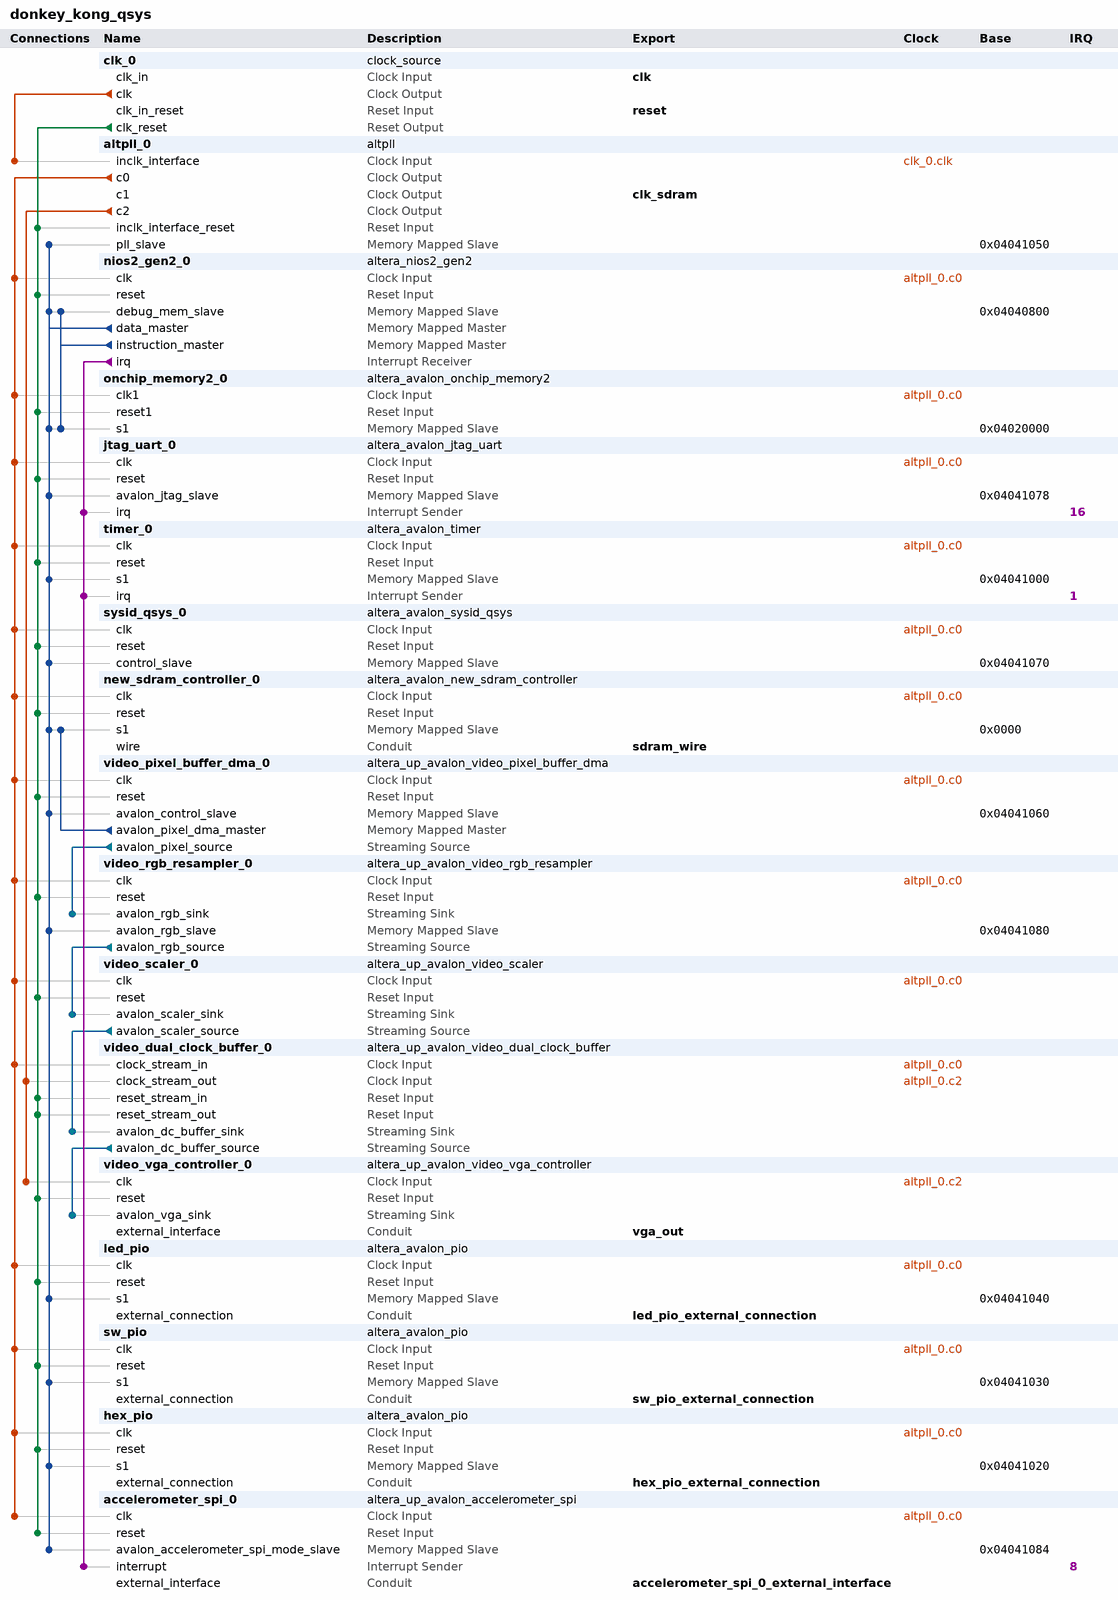
[diagram p0: system contents]
# Platform Designer (Qsys) system donkey_kong_qsys, MAX 10 10M50DAF484C7G
# Parameters at their usual value, and those the tool derives, are not listed.
package require -exact qsys 18.1
create_system donkey_kong_qsys
set_project_property DEVICE_FAMILY {MAX 10}
set_project_property DEVICE 10M50DAF484C7G

add_instance clk_0 clock_source 18.1
set_instance_parameter_value clk_0 clockFrequency 50000000

add_instance altpll_0 altpll 18.1
set_instance_parameter_value altpll_0 CLK0_DIVIDE_BY 1
set_instance_parameter_value altpll_0 CLK0_MULTIPLY_BY 1
set_instance_parameter_value altpll_0 CLK1_DIVIDE_BY 1
set_instance_parameter_value altpll_0 CLK1_DUTY_CYCLE 50
set_instance_parameter_value altpll_0 CLK1_MULTIPLY_BY 1
set_instance_parameter_value altpll_0 CLK1_PHASE_SHIFT -3000
set_instance_parameter_value altpll_0 CLK2_DIVIDE_BY 2
set_instance_parameter_value altpll_0 CLK2_DUTY_CYCLE 50
set_instance_parameter_value altpll_0 CLK2_MULTIPLY_BY 1
set_instance_parameter_value altpll_0 CLK2_PHASE_SHIFT 0
set_instance_parameter_value altpll_0 INCLK0_INPUT_FREQUENCY 20000
set_instance_parameter_value altpll_0 PORT_ARESET PORT_UNUSED
set_instance_parameter_value altpll_0 PORT_LOCKED PORT_UNUSED
set_instance_parameter_value altpll_0 PORT_clk1 PORT_USED
set_instance_parameter_value altpll_0 PORT_clk2 PORT_USED
set_instance_parameter_value altpll_0 PORT_clk3 PORT_UNUSED

add_instance nios2_gen2_0 altera_nios2_gen2 18.1
set_instance_parameter_value nios2_gen2_0 dcache_size 2048
set_instance_parameter_value nios2_gen2_0 exceptionSlave onchip_memory2_0.s1
set_instance_parameter_value nios2_gen2_0 icache_size 4096
set_instance_parameter_value nios2_gen2_0 impl Fast
set_instance_parameter_value nios2_gen2_0 resetSlave onchip_memory2_0.s1

add_instance onchip_memory2_0 altera_avalon_onchip_memory2 18.1
set_instance_parameter_value onchip_memory2_0 dataWidth 32
set_instance_parameter_value onchip_memory2_0 dualPort false
set_instance_parameter_value onchip_memory2_0 initMemContent true
set_instance_parameter_value onchip_memory2_0 initializationFileName onchip_mem.hex
set_instance_parameter_value onchip_memory2_0 memorySize 100000

add_instance jtag_uart_0 altera_avalon_jtag_uart 18.1
set_instance_parameter_value jtag_uart_0 simInteractiveOptions NO_INTERACTIVE_WINDOWS

add_instance timer_0 altera_avalon_timer 18.1
set_instance_parameter_value timer_0 period 1
set_instance_parameter_value timer_0 periodUnits MSEC

add_instance sysid_qsys_0 altera_avalon_sysid_qsys 18.1
set_instance_parameter_value sysid_qsys_0 id 0

add_instance new_sdram_controller_0 altera_avalon_new_sdram_controller 18.1
set_instance_parameter_value new_sdram_controller_0 TAC 5.5
set_instance_parameter_value new_sdram_controller_0 TRCD 20.0
set_instance_parameter_value new_sdram_controller_0 TRP 20.0
set_instance_parameter_value new_sdram_controller_0 casLatency 3
set_instance_parameter_value new_sdram_controller_0 columnWidth 10
set_instance_parameter_value new_sdram_controller_0 dataWidth 16
set_instance_parameter_value new_sdram_controller_0 generateSimulationModel false
set_instance_parameter_value new_sdram_controller_0 model single_Micron_MT48LC4M32B2_7_chip
set_instance_parameter_value new_sdram_controller_0 numberOfBanks 4
set_instance_parameter_value new_sdram_controller_0 numberOfChipSelects 1
set_instance_parameter_value new_sdram_controller_0 powerUpDelay 100.0
set_instance_parameter_value new_sdram_controller_0 refreshPeriod 7.8125
set_instance_parameter_value new_sdram_controller_0 rowWidth 13

add_instance video_pixel_buffer_dma_0 altera_up_avalon_video_pixel_buffer_dma 18.0
set_instance_parameter_value video_pixel_buffer_dma_0 addr_mode X-Y
set_instance_parameter_value video_pixel_buffer_dma_0 back_start_address 17825792
set_instance_parameter_value video_pixel_buffer_dma_0 color_space {16-bit RGB}
set_instance_parameter_value video_pixel_buffer_dma_0 image_height 240
set_instance_parameter_value video_pixel_buffer_dma_0 image_width 320
set_instance_parameter_value video_pixel_buffer_dma_0 start_address 16777216

add_instance video_rgb_resampler_0 altera_up_avalon_video_rgb_resampler 18.0
set_instance_parameter_value video_rgb_resampler_0 alpha 1023
set_instance_parameter_value video_rgb_resampler_0 input_type {16-bit RGB}
set_instance_parameter_value video_rgb_resampler_0 output_type {30-bit RGB}

add_instance video_scaler_0 altera_up_avalon_video_scaler 18.0
set_instance_parameter_value video_scaler_0 color_bits 10
set_instance_parameter_value video_scaler_0 color_planes 3
set_instance_parameter_value video_scaler_0 height_scaling 2
set_instance_parameter_value video_scaler_0 width_in 320
set_instance_parameter_value video_scaler_0 width_scaling 2

add_instance video_dual_clock_buffer_0 altera_up_avalon_video_dual_clock_buffer 18.0
set_instance_parameter_value video_dual_clock_buffer_0 color_bits 10

add_instance video_vga_controller_0 altera_up_avalon_video_vga_controller 18.0
set_instance_parameter_value video_vga_controller_0 board DE10-Lite
set_instance_parameter_value video_vga_controller_0 resolution {VGA 640x480}

add_instance led_pio altera_avalon_pio 18.1
set_instance_parameter_value led_pio direction Output
set_instance_parameter_value led_pio width 8

add_instance sw_pio altera_avalon_pio 18.1
set_instance_parameter_value sw_pio direction Input
set_instance_parameter_value sw_pio width 8

add_instance hex_pio altera_avalon_pio 18.1
set_instance_parameter_value hex_pio direction Output
set_instance_parameter_value hex_pio width 16

add_instance accelerometer_spi_0 altera_up_avalon_accelerometer_spi 18.0

# connections
add_connection altpll_0.c0 accelerometer_spi_0.clk clock
add_connection altpll_0.c0 hex_pio.clk clock
add_connection altpll_0.c0 jtag_uart_0.clk clock
add_connection altpll_0.c0 led_pio.clk clock
add_connection altpll_0.c0 new_sdram_controller_0.clk clock
add_connection altpll_0.c0 nios2_gen2_0.clk clock
add_connection altpll_0.c0 onchip_memory2_0.clk1 clock
add_connection altpll_0.c0 sw_pio.clk clock
add_connection altpll_0.c0 sysid_qsys_0.clk clock
add_connection altpll_0.c0 timer_0.clk clock
add_connection altpll_0.c0 video_dual_clock_buffer_0.clock_stream_in clock
add_connection altpll_0.c0 video_pixel_buffer_dma_0.clk clock
add_connection altpll_0.c0 video_rgb_resampler_0.clk clock
add_connection altpll_0.c0 video_scaler_0.clk clock
add_connection altpll_0.c2 video_dual_clock_buffer_0.clock_stream_out clock
add_connection altpll_0.c2 video_vga_controller_0.clk clock
add_connection clk_0.clk altpll_0.inclk_interface clock
add_connection clk_0.clk_reset accelerometer_spi_0.reset reset
add_connection clk_0.clk_reset altpll_0.inclk_interface_reset reset
add_connection clk_0.clk_reset hex_pio.reset reset
add_connection clk_0.clk_reset jtag_uart_0.reset reset
add_connection clk_0.clk_reset led_pio.reset reset
add_connection clk_0.clk_reset new_sdram_controller_0.reset reset
add_connection clk_0.clk_reset nios2_gen2_0.reset reset
add_connection clk_0.clk_reset onchip_memory2_0.reset1 reset
add_connection clk_0.clk_reset sw_pio.reset reset
add_connection clk_0.clk_reset sysid_qsys_0.reset reset
add_connection clk_0.clk_reset timer_0.reset reset
add_connection clk_0.clk_reset video_dual_clock_buffer_0.reset_stream_in reset
add_connection clk_0.clk_reset video_dual_clock_buffer_0.reset_stream_out reset
add_connection clk_0.clk_reset video_pixel_buffer_dma_0.reset reset
add_connection clk_0.clk_reset video_rgb_resampler_0.reset reset
add_connection clk_0.clk_reset video_scaler_0.reset reset
add_connection clk_0.clk_reset video_vga_controller_0.reset reset
add_connection nios2_gen2_0.data_master accelerometer_spi_0.avalon_accelerometer_spi_mode_slave avalon
set_connection_parameter_value nios2_gen2_0.data_master/accelerometer_spi_0.avalon_accelerometer_spi_mode_slave baseAddress 0x04041084
add_connection nios2_gen2_0.data_master altpll_0.pll_slave avalon
set_connection_parameter_value nios2_gen2_0.data_master/altpll_0.pll_slave baseAddress 0x04041050
add_connection nios2_gen2_0.data_master hex_pio.s1 avalon
set_connection_parameter_value nios2_gen2_0.data_master/hex_pio.s1 baseAddress 0x04041020
add_connection nios2_gen2_0.data_master jtag_uart_0.avalon_jtag_slave avalon
set_connection_parameter_value nios2_gen2_0.data_master/jtag_uart_0.avalon_jtag_slave baseAddress 0x04041078
add_connection nios2_gen2_0.data_master led_pio.s1 avalon
set_connection_parameter_value nios2_gen2_0.data_master/led_pio.s1 baseAddress 0x04041040
add_connection nios2_gen2_0.data_master new_sdram_controller_0.s1 avalon
set_connection_parameter_value nios2_gen2_0.data_master/new_sdram_controller_0.s1 baseAddress 0x0000
add_connection nios2_gen2_0.data_master nios2_gen2_0.debug_mem_slave avalon
set_connection_parameter_value nios2_gen2_0.data_master/nios2_gen2_0.debug_mem_slave baseAddress 0x04040800
add_connection nios2_gen2_0.data_master onchip_memory2_0.s1 avalon
set_connection_parameter_value nios2_gen2_0.data_master/onchip_memory2_0.s1 baseAddress 0x04020000
add_connection nios2_gen2_0.data_master sw_pio.s1 avalon
set_connection_parameter_value nios2_gen2_0.data_master/sw_pio.s1 baseAddress 0x04041030
add_connection nios2_gen2_0.data_master sysid_qsys_0.control_slave avalon
set_connection_parameter_value nios2_gen2_0.data_master/sysid_qsys_0.control_slave baseAddress 0x04041070
add_connection nios2_gen2_0.data_master timer_0.s1 avalon
set_connection_parameter_value nios2_gen2_0.data_master/timer_0.s1 baseAddress 0x04041000
add_connection nios2_gen2_0.data_master video_pixel_buffer_dma_0.avalon_control_slave avalon
set_connection_parameter_value nios2_gen2_0.data_master/video_pixel_buffer_dma_0.avalon_control_slave baseAddress 0x04041060
add_connection nios2_gen2_0.data_master video_rgb_resampler_0.avalon_rgb_slave avalon
set_connection_parameter_value nios2_gen2_0.data_master/video_rgb_resampler_0.avalon_rgb_slave baseAddress 0x04041080
add_connection nios2_gen2_0.instruction_master nios2_gen2_0.debug_mem_slave avalon
set_connection_parameter_value nios2_gen2_0.instruction_master/nios2_gen2_0.debug_mem_slave baseAddress 0x04040800
add_connection nios2_gen2_0.instruction_master onchip_memory2_0.s1 avalon
set_connection_parameter_value nios2_gen2_0.instruction_master/onchip_memory2_0.s1 baseAddress 0x04020000
add_connection video_pixel_buffer_dma_0.avalon_pixel_dma_master new_sdram_controller_0.s1 avalon
set_connection_parameter_value video_pixel_buffer_dma_0.avalon_pixel_dma_master/new_sdram_controller_0.s1 baseAddress 0x0000
add_connection video_dual_clock_buffer_0.avalon_dc_buffer_source video_vga_controller_0.avalon_vga_sink avalon_streaming
add_connection video_pixel_buffer_dma_0.avalon_pixel_source video_rgb_resampler_0.avalon_rgb_sink avalon_streaming
add_connection video_rgb_resampler_0.avalon_rgb_source video_scaler_0.avalon_scaler_sink avalon_streaming
add_connection video_scaler_0.avalon_scaler_source video_dual_clock_buffer_0.avalon_dc_buffer_sink avalon_streaming
add_connection nios2_gen2_0.irq accelerometer_spi_0.interrupt interrupt
set_connection_parameter_value nios2_gen2_0.irq/accelerometer_spi_0.interrupt irqNumber 8
add_connection nios2_gen2_0.irq jtag_uart_0.irq interrupt
set_connection_parameter_value nios2_gen2_0.irq/jtag_uart_0.irq irqNumber 16
add_connection nios2_gen2_0.irq timer_0.irq interrupt
set_connection_parameter_value nios2_gen2_0.irq/timer_0.irq irqNumber 1

# exported interfaces
add_interface accelerometer_spi_0_external_interface conduit end
set_interface_property accelerometer_spi_0_external_interface EXPORT_OF accelerometer_spi_0.external_interface
add_interface clk clock sink
set_interface_property clk EXPORT_OF clk_0.clk_in
add_interface clk_sdram clock source
set_interface_property clk_sdram EXPORT_OF altpll_0.c1
add_interface hex_pio_external_connection conduit end
set_interface_property hex_pio_external_connection EXPORT_OF hex_pio.external_connection
add_interface led_pio_external_connection conduit end
set_interface_property led_pio_external_connection EXPORT_OF led_pio.external_connection
add_interface reset reset sink
set_interface_property reset EXPORT_OF clk_0.clk_in_reset
add_interface sdram_wire conduit end
set_interface_property sdram_wire EXPORT_OF new_sdram_controller_0.wire
add_interface sw_pio_external_connection conduit end
set_interface_property sw_pio_external_connection EXPORT_OF sw_pio.external_connection
add_interface vga_out conduit end
set_interface_property vga_out EXPORT_OF video_vga_controller_0.external_interface

set_interconnect_requirement {$system} qsys_mm.clockCrossingAdapter HANDSHAKE
set_interconnect_requirement {$system} qsys_mm.enableEccProtection FALSE
set_interconnect_requirement {$system} qsys_mm.insertDefaultSlave FALSE
set_interconnect_requirement {$system} qsys_mm.maxAdditionalLatency 1

save_system donkey_kong_qsys.qsys
